# Altium schematic sheet Reloader.SchDoc
size A4; Organization: Altium Limited; Address1: L3, 12a Rodborough Rd; Address2: Frenchs Forest; Address3: NSW; Address4: Australia 2086
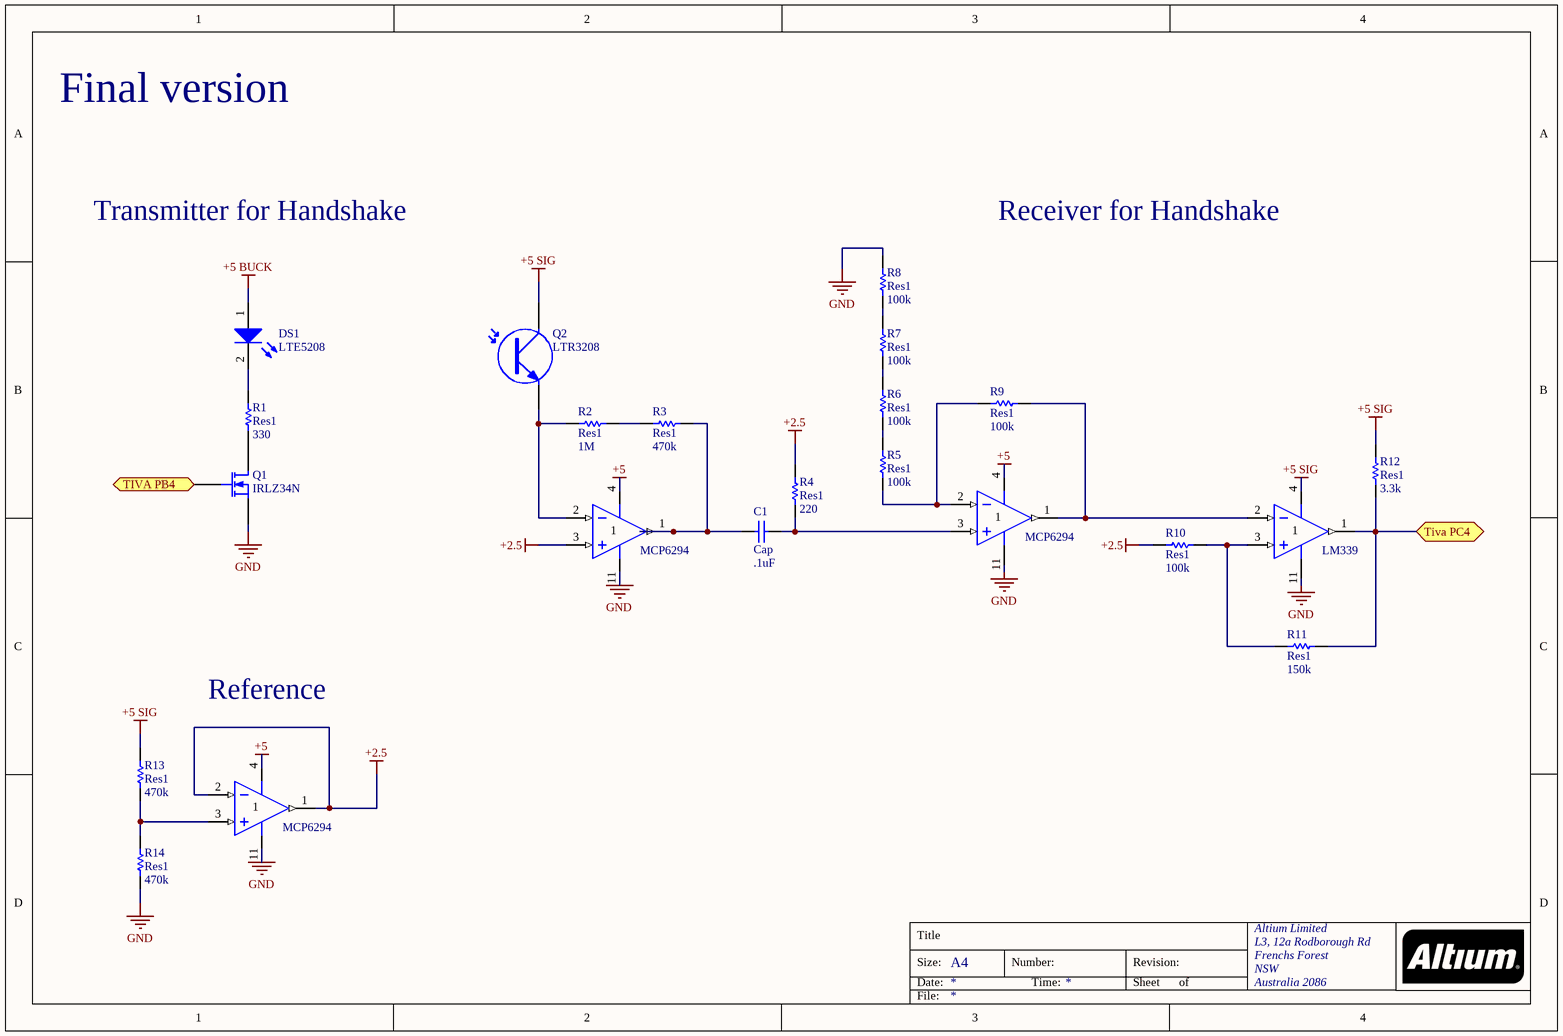
[diagram p0: Reloader.SchDoc]

## Parts
C1  Cap  value .1uF  [RAD-0.3]
DS1  LTE5208  [LED-0]
Q1  IRLZ34N  [BCY-W3/H.8]
Q2  LTR3208  [SFM-T2(3)/X1.6V]
R1  Res1  value 330  [AXIAL-0.3]
R2  Res1  value 1M  [AXIAL-0.3]
R3  Res1  value 470k  [AXIAL-0.3]
R4  Res1  value 220  [AXIAL-0.3]
R5  Res1  value 100k  [AXIAL-0.3]
R6  Res1  value 100k  [AXIAL-0.3]
R7  Res1  value 100k  [AXIAL-0.3]
R8  Res1  value 100k  [AXIAL-0.3]
R9  Res1  value 100k  [AXIAL-0.3]
R10  Res1  value 100k  [AXIAL-0.3]
R11  Res1  value 150k  [AXIAL-0.3]
R12  Res1  value 3.3k  [AXIAL-0.3]
R13  Res1  value 470k  [AXIAL-0.3]
R14  Res1  value 470k  [AXIAL-0.3]
U1  MCP6294  [DIP-14]  (part A of 4)
U2  MCP6294  [DIP-14]  (part A of 4)
U3  LM339  [DIP-14]  (part A of 4)
U4  MCP6294  [DIP-14]  (part A of 4)

## Ports
TIVA PB4, Tiva PC4

## Nets
+2.5: R4.2 R10.2 U1.3(IN+) U4.1(OUT) U4.2(IN-)
+5: U1.4(V+) U2.4(V+) U4.4(V+)
+5 BUCK: DS1.1(A)
+5 SIG: Q2.1(C) R12.1 R13.1 U3.4(V+)
GND: Q1.3(S) R8.2 R14.2 U1.11(GND) U2.11(GND) U3.11(GND) U4.11(GND)
TIVA PB4: Q1.2(G) ; port TIVA PB4
Tiva PC4: R11.1 R12.2 U3.1(OUT) ; port Tiva PC4
NetC1_1: C1.1 R3.2 U1.1(OUT)
NetC1_2: C1.2 R4.1 U2.3(IN+)
NetDS1_2: DS1.2(K) R1.2
NetQ1_1: Q1.1(D) R1.1
NetQ2_3: Q2.3(E) R2.1 U1.2(IN-)
NetR2_2: R2.2 R3.1
NetR5_1: R5.1 R9.2 U2.2(IN-)
NetR5_2: R5.2 R6.1
NetR6_2: R6.2 R7.1
NetR7_2: R7.2 R8.1
NetR9_1: R9.1 U2.1(OUT) U3.2(IN-)
NetR10_1: R10.1 R11.2 U3.3(IN+)
NetR13_2: R13.2 R14.1 U4.3(IN+)

## Notes on the sheet
- Final version
- Transmitter for Handshake
- Receiver for Handshake
- Reference
- Title
- Size:
- Date:
- A4
- Number:
- Time:
- Revision:
- Sheet
- of
- File:

## Library data of the parts
C1 = Cap: Capacitor; Manufacturer: Generic Components; Class: Passive; Published: 08/06/2000; Publisher: Altium Hobart Technology Centre; SubClass: Capacitor
DS1 = LED0: Typical INFRARED GaAs LED; Manufacturer: Generic Components; Class: Optoelectronic; Published: 08/06/2000; Publisher: Altium Hobart Technology Centre; SubClass: LED
Q1 = MOSFET-N: N-Channel MOSFET; Manufacturer: Generic Components; Class: Discrete; SubClass: MOSFET - Low Power; Published: 08/06/2000; Publisher: Altium Hobart Technology Centre
Q2 = Photo NPN: NPN Phototransistor; Manufacturer: Generic Components; Class: Optoelectronic; Published: 1999
R1-R14 = Res1: Resistor; Manufacturer: Generic Components; Class: Passive; Published: 08/06/2000; Publisher: Altium Hobart Technology Centre; SubClass: Resistor
U1-U4 = LM324AJ: Low-Power Quad Operational Amplifier; Manufacturer: National Semiconductor; Published: 15/04/2002; Publisher: Altium Hobart Technology Centre; Class: Amplifier; SubClass: Operational Amplifier